# EAGLE design 2019_Dashboard_1-28-19 (EAGLE 9.1.3)
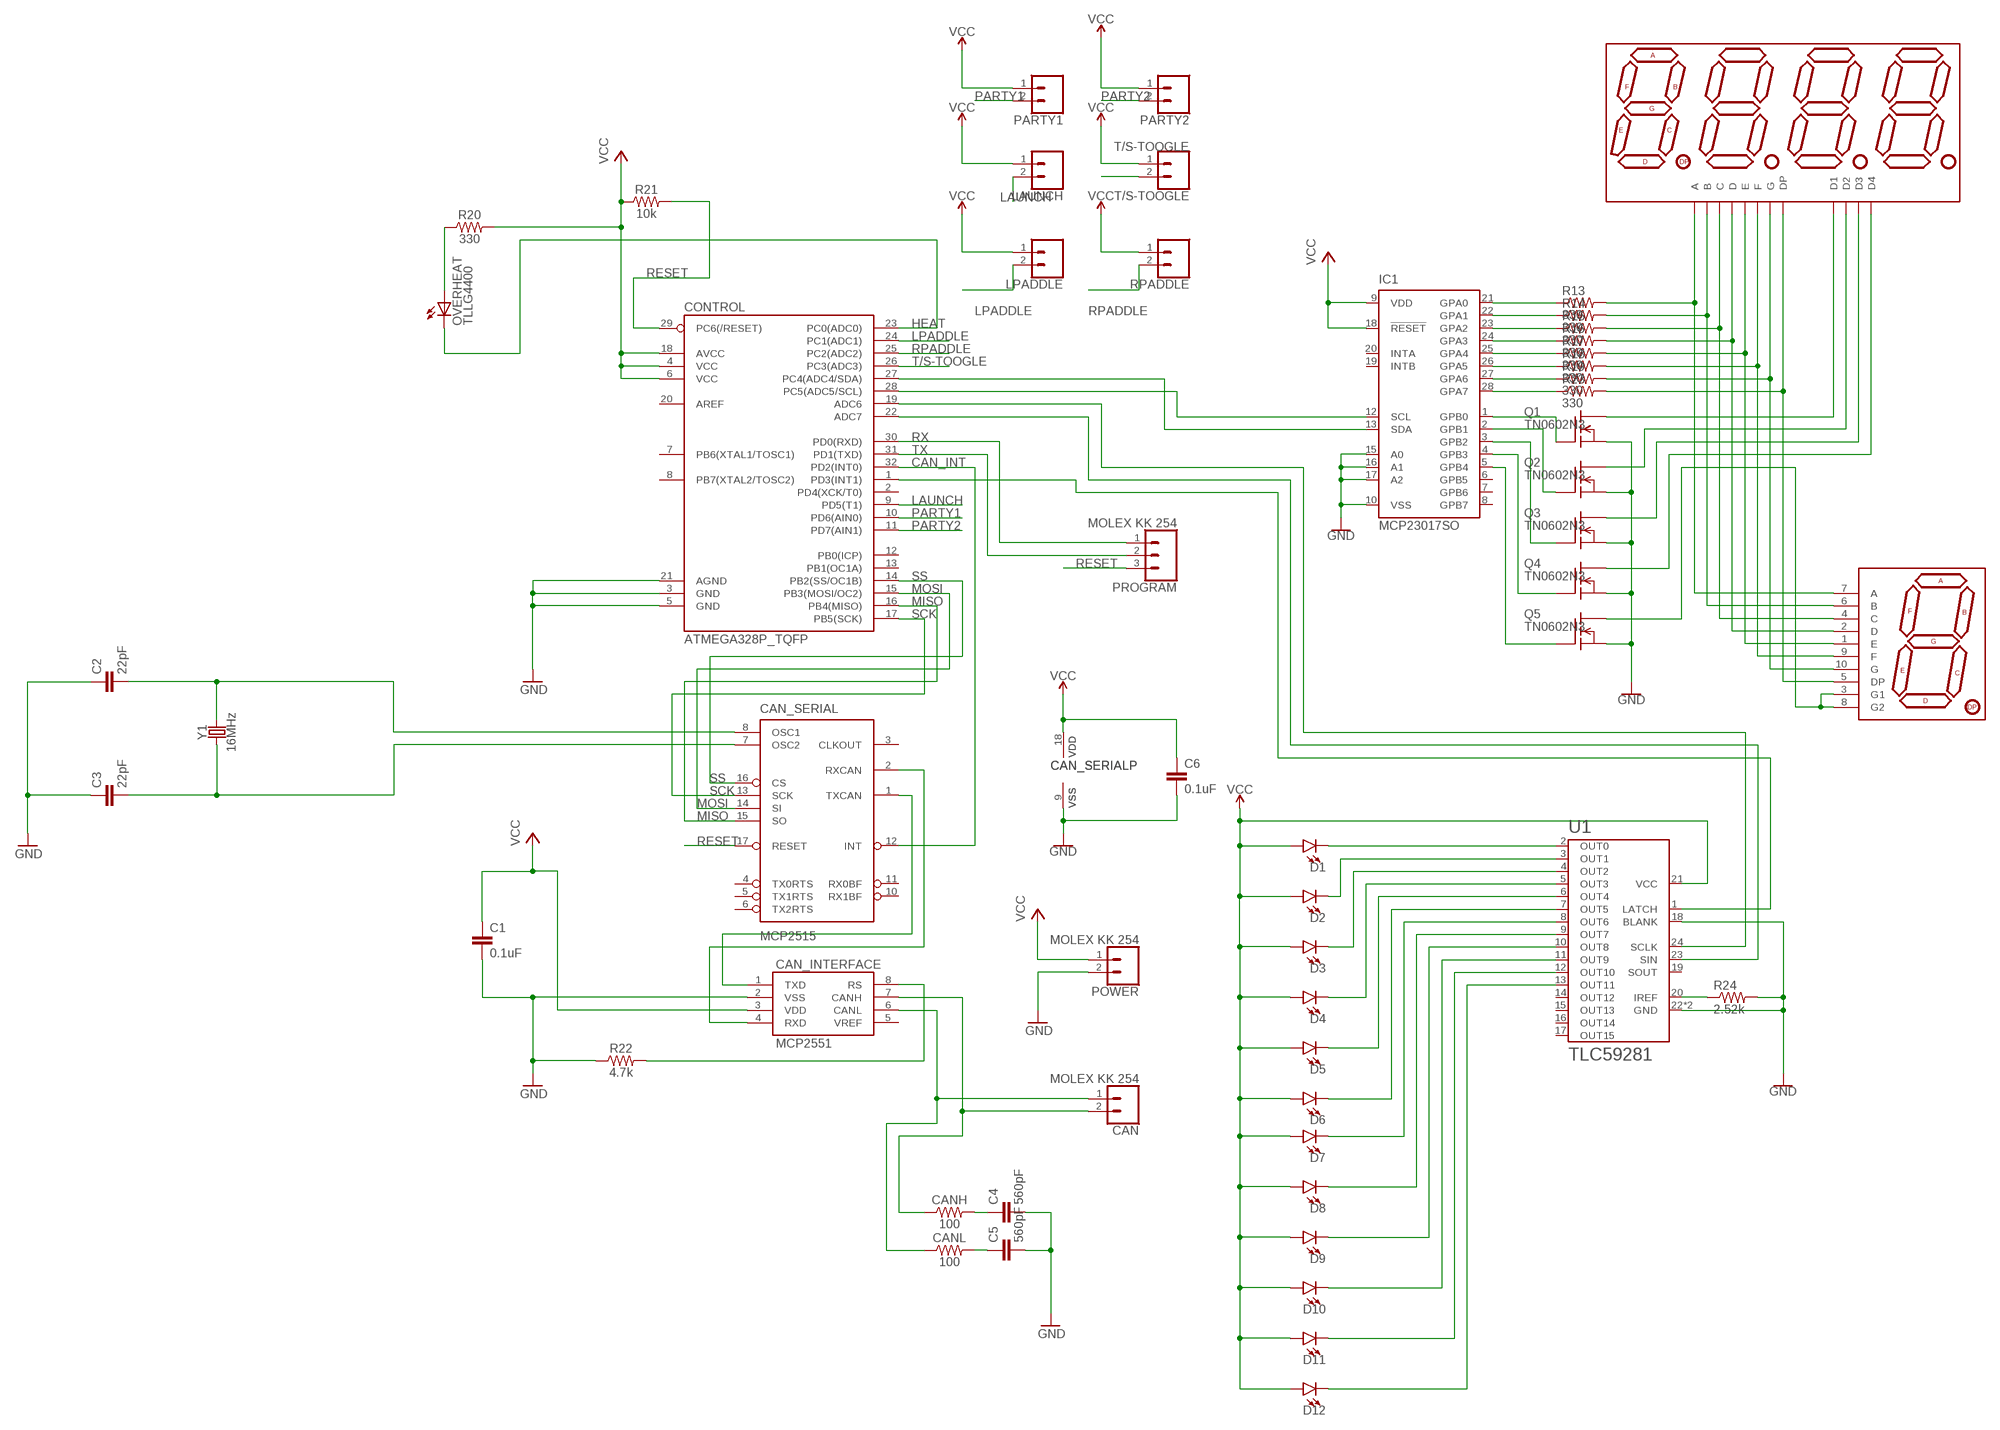
[diagram p0: schematic, sheet 1]

## Parts
C1  0.1uF  0.1UF-0603-25V-(+80/-20%)  [0603]
C2  22pF  22PF-0603-50V-5%  [0603]
C3  22pF  22PF-0603-50V-5%  [0603]
C4  560pF  560PF-0603-50V-5%  [0603]
C5  560pF  560PF-0603-50V-5%  [0603]
C6  0.1uF  0.1UF-0402-16V-10%  [0402]
CAN  MOLEX KK 254  CONN_02  [1X02]
CAN_INTERFACE  MCP2551  [SO08]
CAN_SERIAL  MCP2515  MCP2515(MCP2510)SO  [SO18W]
CANH  100  100OHM-0603-1/4W-5%  [0603]
CANL  100  100OHM-0603-1/4W-5%  [0603]
CONTROL  ATMEGA328P_TQFP  [TQFP32-08]
D1  LED5MM  [LED_5MM]
D2  LED5MM  [LED_5MM]
D3  LED5MM  [LED_5MM]
D4  LED5MM  [LED_5MM]
D5  LED5MM  [LED_5MM]
D6  LED5MM  [LED_5MM]
D7  LED5MM  [LED_5MM]
D8  LED5MM  [LED_5MM]
D9  LED5MM  [LED_5MM]
D10  LED5MM  [LED_5MM]
D11  LED5MM  [LED_5MM]
D12  LED5MM  [LED_5MM]
DISP1  ATA8041ARBJ  7-SEGMENT-4DIGIT-20MM-RED  [7-SEGMENT-4DIGIT-20MM]
IC1  MCP23017SO  [SO28W]
LAUNCH  CONN_02LOCK  [1X02_LOCK]
LPADDLE  CONN_02LOCK  [1X02_LOCK]
OVERHEAT  TLLG4400  [LED3MM]
PARTY1  CONN_02LOCK  [1X02_LOCK]
PARTY2  CONN_02LOCK  [1X02_LOCK]
POWER  MOLEX KK 254  CONN_02  [1X02]
PROGRAM  MOLEX KK 254  CONN_03  [1X03]
Q1  TN0602N3  [TO-92]
Q2  TN0602N3  [TO-92]
Q3  TN0602N3  [TO-92]
Q4  TN0602N3  [TO-92]
Q5  TN0602N3  [TO-92]
R13  330  R-US_R0603  [R0603]
R14  330  R-US_R0603  [R0603]
R15  330  R-US_R0603  [R0603]
R16  330  R-US_R0603  [R0603]
R17  330  R-US_R0603  [R0603]
R18  330  R-US_R0603  [R0603]
R19  330  R-US_R0603  [R0603]
R20  330  330OHM-0603-1/10W-1%  [0603]
R21  10k  10KOHM-0603-1/10W-1%  [0603]
R22  4.7k  4.7KOHM-0603-1/10W-1%  [0603]
R23  330  R-US_R0603  [R0603]
R24  2.52k  R-US_R0603  [R0603]
RPADDLE  CONN_02LOCK  [1X02_LOCK]
T/S-TOOGLE  CONN_02LOCK  [1X02_LOCK]
U1  TLC59281  [QFN-24]
U$1  YSD-1601AR4B-8  7-SEGMENT-1DIGIT-1INCH-RED  [7-SEGMENT-1"PTH]
Y1  16MHz  CRYSTAL-16MHZPTH-HC49US  [HC49US]

## Nets
CAN_INT: CAN_SERIAL.12(INT) CONTROL.32(PD2(INT0))
CANH: CAN.2 CAN_INTERFACE.7(CANH) CANH.1
CANL: CAN.1 CAN_INTERFACE.6(CANL) CANL.1
CHI: C4.1 CANH.2
CI_SLOPE: CAN_INTERFACE.8(RS) R22.2
CLI: C5.1 CANL.2
GND [power]: C1.2 C2.1 C3.1 C4.2 C5.2 C6.2 CAN_INTERFACE.2(VSS) CAN_SERIAL.9(VSS) CONTROL.3(GND) CONTROL.5(GND) CONTROL.21(AGND) IC1.10(VSS) IC1.15(A0) IC1.16(A1) IC1.17(A2) POWER.2 Q1.1(S) Q2.1(S) Q3.1(S) Q4.1(S) Q5.1(S) R22.1 R24.2 U1.18(BLANK) U1.22(GND) U1.EP(GND)
HEAT: CONTROL.23(PC0(ADC0)) OVERHEAT.K(C)
HEAT+: OVERHEAT.A R20.1
LAUNCH: CONTROL.9(PD5(T1)) LAUNCH.2
LPADDLE: CONTROL.24(PC1(ADC1)) LPADDLE.2
MISO: CAN_SERIAL.15(SO) CONTROL.16(PB4(MISO))
MOSI: CAN_SERIAL.14(SI) CONTROL.15(PB3(MOSI/OC2))
N$1: CONTROL.28(PC5(ADC5/SCL)) IC1.12(SCL)
N$2: CONTROL.27(PC4(ADC4/SDA)) IC1.13(SDA)
N$3 [led]: DISP1.11(A) R13.2 U$1.7(A)
N$4 [led]: DISP1.7(B) R14.2 U$1.6(B)
N$5 [led]: DISP1.4(C) R15.2 U$1.4(C)
N$6 [led]: DISP1.2(D) R16.2 U$1.2(D)
N$7 [led]: DISP1.1(E) R17.2 U$1.1(E)
N$8 [led]: DISP1.10(F) R18.2 U$1.9(F)
N$9 [led]: DISP1.5(G) R19.2 U$1.10(G)
N$10 [led]: DISP1.3(DP) R23.2 U$1.5(DP)
N$11 [led]: DISP1.12(D1) Q1.3(D)
N$12 [led]: DISP1.9(D2) Q2.3(D)
N$13 [led]: DISP1.8(D3) Q3.3(D)
N$14 [led]: DISP1.6(D4) Q4.3(D)
N$15 [led]: Q5.3(D) U$1.3(G1) U$1.8(G2)
N$18: CONTROL.19(ADC6) U1.24(SCLK)
N$19: CONTROL.22(ADC7) U1.23(SIN)
N$20: CONTROL.1(PD3(INT1)) U1.1(LATCH)
N$28: IC1.21(GPA0) R13.1
N$29: IC1.22(GPA1) R14.1
N$30: IC1.23(GPA2) R15.1
N$31: IC1.24(GPA3) R16.1
N$32: IC1.25(GPA4) R17.1
N$33: IC1.26(GPA5) R18.1
N$46: IC1.27(GPA6) R19.1
N$47: IC1.28(GPA7) R23.1
N$48: IC1.1(GPB0) Q1.2(G)
N$49: IC1.2(GPB1) Q2.2(G)
N$50: IC1.3(GPB2) Q3.2(G)
N$51: IC1.4(GPB3) Q4.2(G)
N$52: IC1.5(GPB4) Q5.2(G)
N$53: D1.K(C) U1.2(OUT0)
N$54: D2.K(C) U1.3(OUT1)
N$55: D3.K(C) U1.4(OUT2)
N$56: D4.K(C) U1.5(OUT3)
N$57: CAN_INTERFACE.1(TXD) CAN_SERIAL.1(TXCAN)
N$58: CAN_INTERFACE.4(RXD) CAN_SERIAL.2(RXCAN)
N$59: D5.K(C) U1.6(OUT4)
N$60: D6.K(C) U1.7(OUT5)
N$61: D7.K(C) U1.8(OUT6)
N$62: D8.K(C) U1.9(OUT7)
N$63: D9.K(C) U1.10(OUT8)
N$64: D10.K(C) U1.11(OUT9)
N$65: D11.K(C) U1.12(OUT10)
N$66: D12.K(C) U1.13(OUT11)
N$67: R24.1 U1.20(IREF)
OSC1: C2.2 CAN_SERIAL.8(OSC1) Y1.2
OSC2: C3.2 CAN_SERIAL.7(OSC2) Y1.1
PARTY1: CONTROL.10(PD6(AIN0)) PARTY1.2
PARTY2: CONTROL.11(PD7(AIN1)) PARTY2.2
RESET: CAN_SERIAL.17(RESET) CONTROL.29(PC6(/RESET)) PROGRAM.3 R21.2
RPADDLE: CONTROL.25(PC2(ADC2)) RPADDLE.2
RX: CONTROL.30(PD0(RXD)) PROGRAM.1
SCK: CAN_SERIAL.13(SCK) CONTROL.17(PB5(SCK))
SS: CAN_SERIAL.16(CS) CONTROL.14(PB2(SS/OC1B))
T/S-TOOGLE: CONTROL.26(PC3(ADC3)) T/S-TOOGLE.2
TX: CONTROL.31(PD1(TXD)) PROGRAM.2
VCC [power]: C1.1 C6.1 CAN_INTERFACE.3(VDD) CAN_SERIAL.18(VDD) CONTROL.4(VCC) CONTROL.6(VCC) CONTROL.18(AVCC) D1.A D2.A D3.A D4.A D5.A D6.A D7.A D8.A D9.A D10.A D11.A D12.A IC1.9(VDD) IC1.18(!RESET) LAUNCH.1 LPADDLE.1 PARTY1.1 PARTY2.1 POWER.1 R20.2 R21.1 RPADDLE.1 T/S-TOOGLE.1 U1.21(VCC)
Unconnected: CAN_INTERFACE.5(VREF) CAN_SERIAL.3(CLKOUT) CAN_SERIAL.4(TX0RTS) CAN_SERIAL.5(TX1RTS) CAN_SERIAL.6(TX2RTS) CAN_SERIAL.10(RX1BF) CAN_SERIAL.11(RX0BF) CONTROL.2(PD4(XCK/T0)) CONTROL.7(PB6(XTAL1/TOSC1)) CONTROL.8(PB7(XTAL2/TOSC2)) CONTROL.12(PB0(ICP)) CONTROL.13(PB1(OC1A)) CONTROL.20(AREF) IC1.6(GPB5) IC1.7(GPB6) IC1.8(GPB7) IC1.19(INTB) IC1.20(INTA) U1.14(OUT12) U1.15(OUT13) U1.16(OUT14) U1.17(OUT15) U1.19(SOUT)

## Library data of the parts
C1 = SparkFun-Capacitors:0.1UF: 0.1µF ceramic capacitors A capacitor is a passive two-terminal electrical component used to store electrical energy temporarily in an electric field.; PROD_ID: CAP-00810
C2 C3 = SparkFun-Capacitors:22PF: 22pF ceramic capacitors A capacitor is a passive two-terminal electrical component used to store electrical energy temporarily in an electric field.; PROD_ID: CAP-07876
C4 C5 = SparkFun-Capacitors:560PF: 0.56nF/560pF ceramic capacitors A capacitor is a passive two-terminal electrical component used to store electrical energy temporarily in an electric field.; PROD_ID: CAP-08749
C6 = SparkFun-Capacitors:0.1UF: 0.1µF ceramic capacitors A capacitor is a passive two-terminal electrical component used to store electrical energy temporarily in an electric field.; PROD_ID: CAP-12416
CAN LAUNCH LPADDLE PARTY1 PARTY2 POWER RPADDLE T/S-TOOGLE = SparkFun-Connectors:CONN_02: Multi connection point. Often used as Generic Header-pin footprint for 0.1 inch spaced/style header connections On any of the 0.1 inch spaced packages, you can populate with these: Break Away Headers - Straight <https://www.sparkfun.com/products/116> (PRT-00116) Break Away Male Headers - Right Angle <https://www.sparkfun.com/products/553> (PRT-00553) Female Headers <https://www.sparkfun.com/products/115> (PRT-00115) Break Away Headers - Machine Pin <https://www.sparkfun.com/products/117> (PRT-00117) Break Away Female Headers - Swiss Machine Pin <https://www.sparkfun.com/products/743> (PRT-00743) For SCREWTERMINALS and SPRING TERMINALS visit here: Screw Terimnals on SparkFun.com <https://www.sparkfun.com/search/results?term=Screw+Terminals> (5mm/3.5mm/2.54mm spacing) This device is also useful as a general connection point to wire up your design to another part of your project. Our various solder wires solder well into these plated through hole pads. Hook-Up Wire - Assortment (Stranded, 22 AWG) <https://www.sparkfun.com/products/11375> (PRT-11375) Hook-Up Wire - Assortment (Solid Core, 22 AWG) <https://www.sparkfun.com/products/11367> (PRT-11367) View the entire wire category on our website here <https://www.sparkfun.com/categories/141> Special notes: Molex polarized connector foot print use with: PRT-08233 with associated crimp pins and housings. 2.54_SCREWTERM for use with PRT-10571. 3.5mm Screw Terminal footprints for PRT-08084 5mm Screw Terminal footprints for use with PRT-08432
CAN_INTERFACE = SparkFun-IC-Comms:MCP2551: MCP2551 High Speed CAN Transceiver High speed CAN transceiver Datasheet <http://www.sparkfun.com/datasheets/DevTools/Arduino/MCP2551.pdf> SparkFun Products CAN-BUS Shield <https://www.sparkfun.com/products/13262> (DEV-13262) SparkFun OBD-II UART <https://www.sparkfun.com/products/9555> (WIG-09555); PROD_ID: IC-09907
CAN_SERIAL = SparkFun-IC-Comms:MCP2515(MCP2510): CAN controller with SPI interface The MCP2515 controller supercedes the MCP2510 while addressing all errata associated with it. The two devices are pin compatible, either can be used with this device. 18-pin package SOIC Simple SPI interface to any MCU. One-shot mode ensures message transmission is attempted only once Databyte filtering Start-of-Frame (SOF) output Low-power CMOS Technology Datasheet <http://www.sparkfun.com/datasheets/DevTools/Arduino/MCP2515.pdf> SparkFun Products CAN-BUS Shield <https://www.sparkfun.com/products/13262> (DEV-13262); PROD_ID: IC-09906
CANH CANL = SparkFun-Resistors:100OHM: 100Ω resistor A resistor is a passive two-terminal electrical component that implements electrical resistance as a circuit element. Resistors act to reduce current flow, and, at the same time, act to lower voltage levels within circuits. - Wikipedia; PROD_ID: RES-12438
CONTROL = SparkFun-IC-Microcontroller:ATMEGA328P_TQFP: Popular 328P in QFP Storefront component: ATmega328 - TQFP <https://www.sparkfun.com/products/13448> (COM-13448) Datasheet <http://www.sparkfun.com/datasheets/Components/SMD/ATMega328.pdf> SparkFun Products SparkFun RedBoard - Programmed with Arduino <https://www.sparkfun.com/products/12757> (DEV-12757) Arduino Pro Mini 328 - 5V/16MHz <https://www.sparkfun.com/products/11113> (DEV-11113) Arduino Pro Mini 328 - 3.3V/8MHz <https://www.sparkfun.com/products/11114> (DEV-11114) SparkFun OpenLog <https://www.sparkfun.com/products/13712> (DEV-13712) SparkFun MicroView - OLED Arduino Module <https://www.sparkfun.com/products/12923> (DEV-12923) SparkFun Digital Sandbox <https://www.sparkfun.com/products/12651> (DEV-12651) SparkFun PicoBoard <https://www.sparkfun.com/products/11888> (WIG-11888) Arduino Fio <https://www.sparkfun.com/products/10116> (DEV-10116) LilyPad Arduino 328 Main Board <https://www.sparkfun.com/products/13342> (DEV-13342) SparkFun RedStick <https://www.sparkfun.com/products/13741> (DEV-13741) LilyPad MP3 <https://www.sparkfun.com/products/11013> (DEV-11013) LilyPad Arduino SimpleSnap <https://www.sparkfun.com/products/10941> (DEV-10941) SparkFun Stepoko <https://www.sparkfun.com/products/13899> (ROB-13899) SparkFun Geiger Counter <https://www.sparkfun.com/products/11345> (SEN-11345) SparkFun EL Sequencer <https://www.sparkfun.com/products/12781> (COM-12781) Arduino Pro 328 - 5V/16MHz <https://www.sparkfun.com/products/10915> (DEV-10915) CryptoCape <https://www.sparkfun.com/products/12773> (DEV-12773) SparkFun IR Thermometer Evaluation Board - MLX90614 <https://www.sparkfun.com/products/10740> (SEN-10740) SparkFun RedBot Mainboard <https://www.sparkfun.com/products/12097> (ROB-12097) Arduino Pro 328 - 3.3V/8MHz <https://www.sparkfun.com/products/10914> (DEV-10914) SparkFun Block for Intel® Edison - Arduino <https://www.sparkfun.com/products/13036> (DEV-13036) SparkFun Simon Says - Surface Mount Soldering Kit <https://www.sparkfun.com/products/10935> (KIT-10935) SparkFun 7-Segment Serial Display - Red <https://www.sparkfun.com/products/11441> (COM-11441) SparkFun 7-Segment Serial Display - White <https://www.sparkfun.com/products/11629> (COM-11629) SparkFun 7-Segment Serial Display - Yellow <https://www.sparkfun.com/products/11443> (COM-11443) SparkFun 7-Segment Serial Display - Kelly Green <https://www.sparkfun.com/products/11440> (COM-11440) SparkFun 7-Segment Serial Display - Blue <https://www.sparkfun.com/products/11442> (COM-11442) SparkFun OpenSegment Serial Display - 20mm (Blue) <https://www.sparkfun.com/products/11647> (COM-11647) SparkFun OpenSegment Serial Display - 20mm (Green) <https://www.sparkfun.com/products/11646> (COM-11646) SparkFun OpenSegment Serial Display - 20mm (White) <https://www.sparkfun.com/products/11648> (COM-11648) SparkFun OpenSegment Serial Display - 20mm (Red) <https://www.sparkfun.com/products/11644> (COM-11644) SparkFun OpenSegment Serial Display - 20mm (Yellow) <https://www.sparkfun.com/products/11645> (COM-11645) SparkFun OpenSegment Shield <https://www.sparkfun.com/products/13190> (DEV-13190); PROD_ID: IC-09069
D1-D12 = SparkFun-LED:LED: LED (Generic) Standard schematic elements and footprints for 5mm, 3mm, 1206, and 0603 sized LEDs. Generic LEDs with no color specified.
DISP1 = SparkFun-LED:7-SEGMENT-4DIGIT-20MM: 4 Digit 7 Segment Display This is a part for the 4-Digit 7-segment LEDs from Young Sun. Different from the Digikey LEDs, all 16 pins are used. The LONGPADS Variant is used for a test jig, but you may like it because there is more pad to solder to. If you are concerned about routing space, the standard works just fine though. Datasheets: Red <http://cdn.sparkfun.com/datasheets/Components/LED/1LEDREDCC.pdf> Yellow <http://cdn.sparkfun.com/datasheets/Components/LED/1LEDYELCC.pdf> Green <http://cdn.sparkfun.com/datasheets/Components/LED/1LEDGRNCC.pdf> Blue <http://cdn.sparkfun.com/datasheets/Components/LED/1LEDBLUCC.pdf> White <http://cdn.sparkfun.com/datasheets/Components/LED/1LEDWHTCC.pdf> SparkFun Products Raw Components 7-Segment Display - 20mm (Red) <https://www.sparkfun.com/products/11405> (COM-11405) 7-Segment Display - 20mm (Yellow) <https://www.sparkfun.com/products/11406> (COM-11406) 7-Segment Display - 20mm (Green) <https://www.sparkfun.com/products/11407> (COM-11407) 7-Segment Display - 20mm (Blue) <https://www.sparkfun.com/products/11408> (COM-11408) 7-Segment Display - 20mm (White) <https://www.sparkfun.com/products/11409> (COM-11409) Serial Controlled SparkFun OpenSegment Serial Display - 20mm (Red) <https://www.sparkfun.com/products/11644> (COM-11644) SparkFun OpenSegment Serial Display - 20mm (Yellow) <https://www.sparkfun.com/products/11645> (COM-11645) SparkFun OpenSegment Serial Display - 20mm (Green) <https://www.sparkfun.com/products/11646> (COM-11646) SparkFun OpenSegment Serial Display - 20mm (Blue) <https://www.sparkfun.com/products/11647> (COM-11647) SparkFun OpenSegment Serial Display - 20mm (White) <https://www.sparkfun.com/products/11648> (COM-11648) Other SparkFun OpenSegment Shield <https://www.sparkfun.com/products/13190> (DEV-13190); PROD_ID: COMP-11449
IC1 = adafruit:MCP23017: http://ww1.microchip.com/downloads/en/DeviceDoc/21952a.pdf Source: http://ww1.microchip.com/downloads/en/DeviceDoc/21952a.pdf
OVERHEAT = led:TLLG4400: Low Current (2mA) LED 3 mm Tinted Diffused Package color GREEN Source: Data sheet <http://www.farnell.com/datasheets/391098.pdf>; MF: VISHAY SEMICONDUCTOR; OC_FARNELL: 1612435
PROGRAM = SparkFun-Connectors:CONN_03: Multi connection point. Often used as Generic Header-pin footprint for 0.1 inch spaced/style header connections On any of the 0.1 inch spaced packages, you can populate with these: Break Away Headers - Straight <https://www.sparkfun.com/products/116> (PRT-00116) Break Away Male Headers - Right Angle <https://www.sparkfun.com/products/553> (PRT-00553) Female Headers <https://www.sparkfun.com/products/115> (PRT-00115) Break Away Headers - Machine Pin <https://www.sparkfun.com/products/117> (PRT-00117) Break Away Female Headers - Swiss Machine Pin <https://www.sparkfun.com/products/743> (PRT-00743) Stackable Header - 3 Pin (Female, 0.1") <https://www.sparkfun.com/products/13875> (PRT-13875) For SCREWTERMINALS and SPRING TERMINALS visit here: Screw Terimnals on SparkFun.com <https://www.sparkfun.com/search/results?term=Screw+Terminals> (5mm/3.5mm/2.54mm spacing) This device is also useful as a general connection point to wire up your design to another part of your project. Our various solder wires solder well into these plated through hole pads. Hook-Up Wire - Assortment (Stranded, 22 AWG) <https://www.sparkfun.com/products/11375> (PRT-11375) Hook-Up Wire - Assortment (Solid Core, 22 AWG) <https://www.sparkfun.com/products/11367> (PRT-11367) View the entire wire category on our website here <https://www.sparkfun.com/categories/141> Special notes: Molex polarized connector foot print use with SKU : PRT-08232 with associated crimp pins and housings.
Q1-Q5 = transistor-fet:TN0602N3: N-Channel Enhancement MOSFET 20V; 4A; 0,75Ohm
R13-R19 R23 R24 = resistor:R-US_: RESISTOR, American symbol
R20 = SparkFun-Resistors:330OHM: 330Ω resistor A resistor is a passive two-terminal electrical component that implements electrical resistance as a circuit element. Resistors act to reduce current flow, and, at the same time, act to lower voltage levels within circuits. - Wikipedia; PROD_ID: RES-00818
R21 = SparkFun-Resistors:10KOHM: 10kΩ resistor A resistor is a passive two-terminal electrical component that implements electrical resistance as a circuit element. Resistors act to reduce current flow, and, at the same time, act to lower voltage levels within circuits. - Wikipedia; PROD_ID: RES-00824
R22 = SparkFun-Resistors:4.7KOHM: 4.7kΩ resistor A resistor is a passive two-terminal electrical component that implements electrical resistance as a circuit element. Resistors act to reduce current flow, and, at the same time, act to lower voltage levels within circuits. - Wikipedia; PROD_ID: RES-07857
U1 = TLC59281:TLC59281; AVAILABILITY: Unavailable; DESCRIPTION: 16-Channel Constant-Current LED Driver without LED Open Detection; MF: Texas Instruments; MP: TLC59281; PACKAGE: None; PRICE: None
U$1 = SparkFun-LED:7-SEGMENT-1DIGIT-1INCH: 7-Segment Display, single digit, 1" EZ is for kits. Pads are only exposed on the bottom side to help prevent soldering in upside down. Datasheet (Red) <https://cdn.sparkfun.com/datasheets/Components/LED/YSD-160AR4B-8.pdf> Datasheet (Blue) <https://cdn.sparkfun.com/datasheets/Components/LED/YSD-160AB3C-8.pdf> SparkFun Products 7-Segment Display - LED (Red) <https://www.sparkfun.com/products/8546> (COM-08546) 7-Segment Display - LED (Blue) <https://www.sparkfun.com/products/9191> (COM-09191); PROD_ID: COMP-08615
Y1 = SparkFun-Clocks:CRYSTAL-16MHZ: 16MHz Crystal Digikey Example <http://www.digikey.com/product-search/en?keywords=535-9122-1-ND> Frequency: 16MHz Frequency Stability: ±50ppm Frequency Tolerance: ±20ppm Load Capacitance: 18pF SparkFun Products: Pro Micro -5V/16MHz <https://www.sparkfun.com/products/12640> SparkFun Serial Enabled LCD Kit <https://www.sparkfun.com/products/10097>; PROD_ID: XTAL-08181; SF_ID: COM-00536

## Net classes
1 power: width 0.406 mm
2 led: width 0.203 mm

## Board
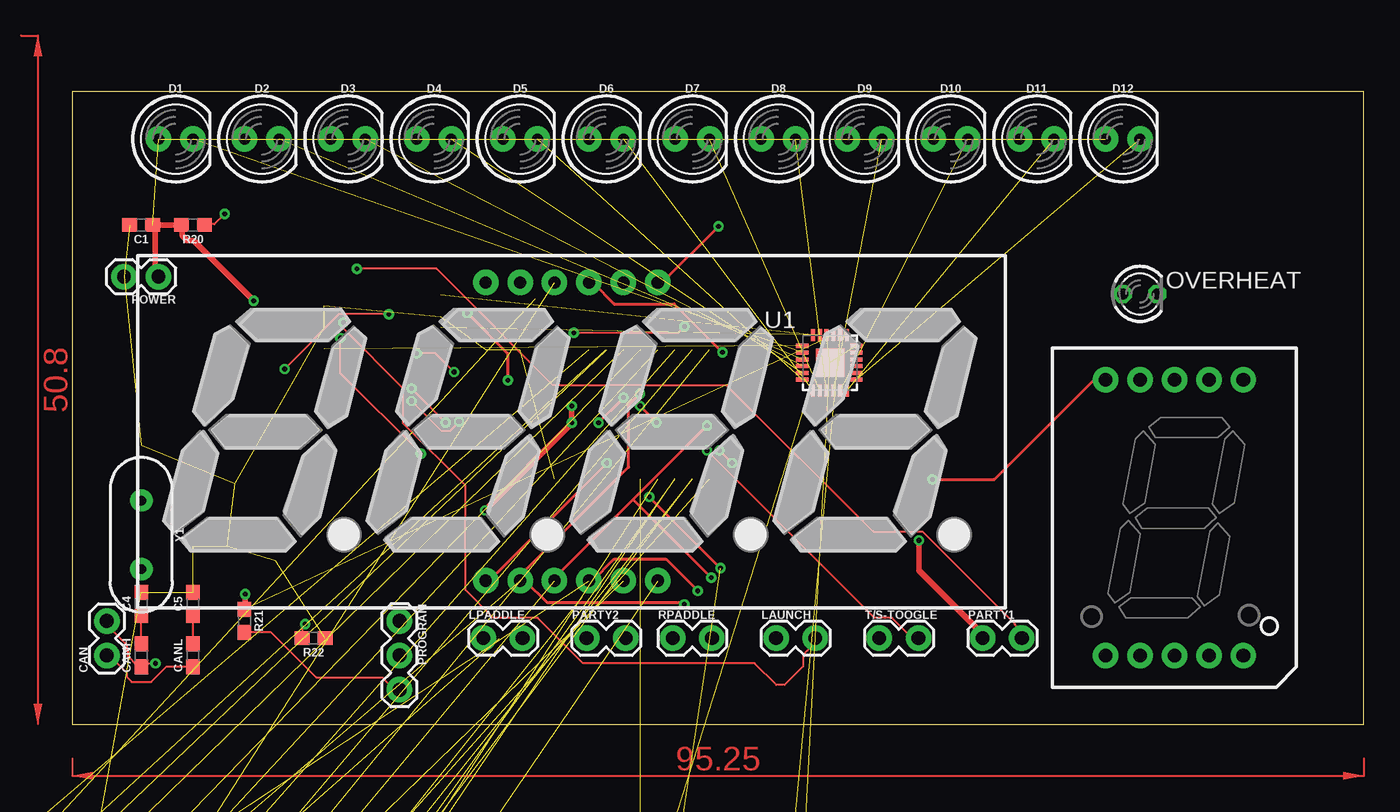
[diagram p1: board, top side]
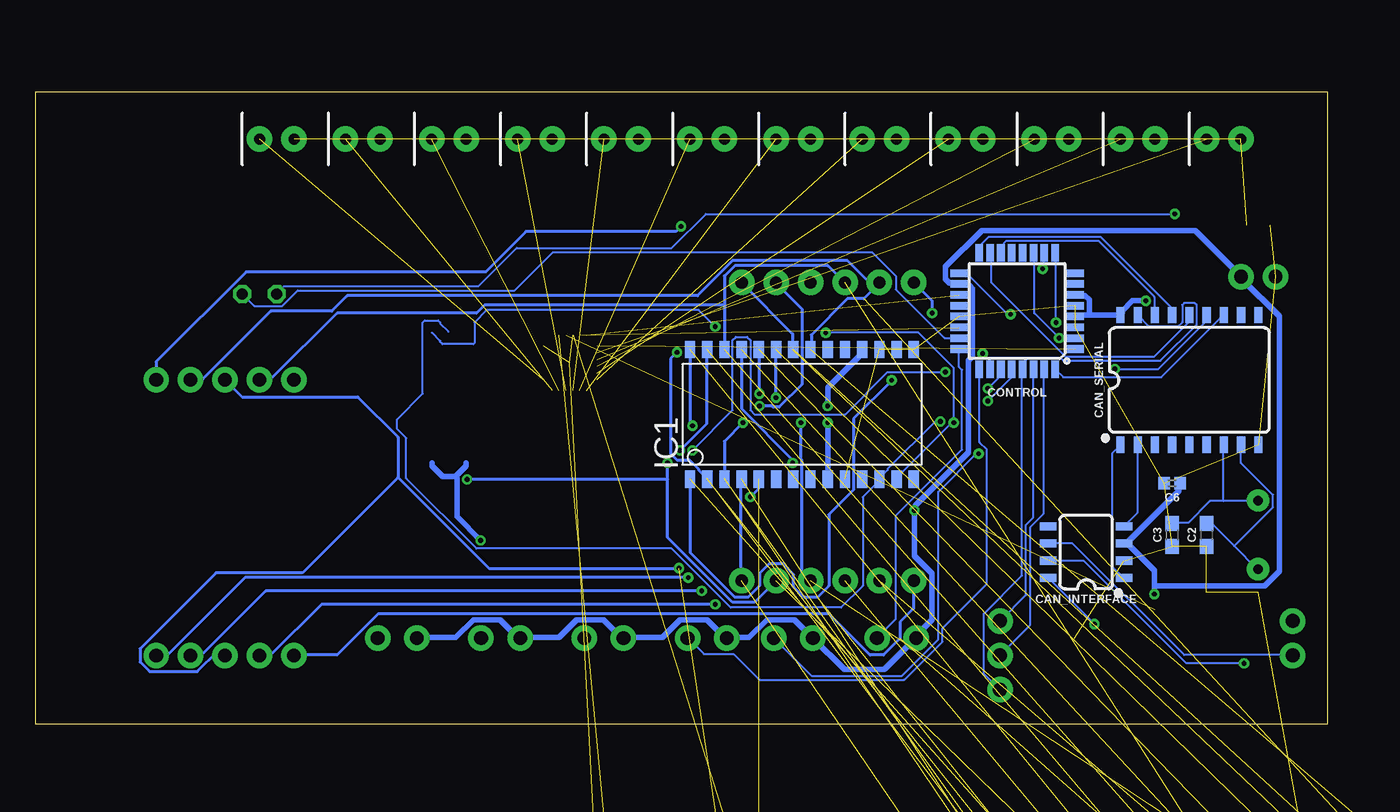
[diagram p2: board, bottom side, seen from below]

Size 95.23 x 46.66 mm. Coordinates in mm from the lower left corner, seen from the top.
Outline: 0,0 95.23,0 95.23,46.66 0,46.66 0,0
Copper layers (1*16): Top 0.035mm / dielectric 1.5mm / Bottom 0.035mm
Design rules "default": minimum track width 6mil, minimum drill 0.35mm, track to track 6mil, track to pad 6mil, pad to pad 6mil, via to via 6mil, smd to smd 6mil, copper to edge 40mil, drill to drill 6mil, minimum pad ring 10mil, minimum via ring 8mil, stop-mask expansion 4mil, vias tented up to drill 0mil, thermal gap 10mil
Holes 1 mm at 137.16,36.83 137.16,46.99 137.16,44.45 137.16,41.91 137.16,39.37 137.16,34.29

### Footprints (pad centres in the part's own frame; a part is rotated, then mirrored left to right if it is on the bottom)
0603 = smd 1.1 x 1: 1 -0.85,0; 2 0.85,0
0402 = smd 0.85 x 0.9: 1 -0.58,0; 2 0.58,0
1X02 = drill 1.016 pad 1.88: 1 0,0; 2 2.54,0
SO08 = smd 0.6 x 1.2: 1 -1.905,-2.8; 2 -0.635,-2.8; 3 0.635,-2.8; 4 1.905,-2.8; 5 1.905,2.8; 6 0.635,2.8; 7 -0.635,2.8; 8 -1.905,2.8
SO18W = smd 0.6 x 1.2: 1 -5.08,-4.788; 2 -3.81,-4.788; 3 -2.54,-4.788; 4 -1.27,-4.788; 5 0,-4.788; 6 1.27,-4.788; 7 2.54,-4.788; 8 3.81,-4.788; 9 5.08,-4.788; 10 5.08,4.788; 11 3.81,4.788; 12 2.54,4.788; 13 1.27,4.788; 14 0,4.788; 15 -1.27,4.788; 16 -2.54,4.788; 17 -3.81,4.788; 18 -5.08,4.788
TQFP32-08 = smd 1.27 x 0.559: 1 -4.293,2.8; 2 -4.293,2; 3 -4.293,1.2; 4 -4.293,0.4; 5 -4.293,-0.4; 6 -4.293,-1.2; 7 -4.293,-2; 8 -4.293,-2.8; 17 4.293,-2.8; 18 4.293,-2; 19 4.293,-1.2; 20 4.293,-0.4; 21 4.293,0.4; 22 4.293,1.2; 23 4.293,2; 24 4.293,2.8 | smd 0.559 x 1.27: 9 -2.8,-4.293; 10 -2,-4.293; 11 -1.2,-4.293; 12 -0.4,-4.293; 13 0.4,-4.293; 14 1.2,-4.293; 15 2,-4.293; 16 2.8,-4.293; 25 2.8,4.293; 26 2,4.293; 27 1.2,4.293; 28 0.4,4.293; 29 -0.4,4.293; 30 -1.2,4.293; 31 -2,4.293; 32 -2.8,4.293
LED_5MM = drill 0.813 pad 1.88: A -1.27,0; K 1.27,0
7-SEGMENT-4DIGIT-20MM = drill 0.9 pad 1.88: 1 -6.35,-10.998; 2 -3.81,-10.998; 3 -1.27,-10.998; 4 1.27,-10.998; 5 3.81,-10.998; 6 6.35,-10.998; 7 6.35,10.998; 8 3.81,10.998; 9 1.27,10.998; 10 -1.27,10.998; 11 -3.81,10.998; 12 -6.35,10.998
SO28W = smd 0.762 x 1.27: 1 -7.62,-4.78; 2 -6.35,-4.78; 3 -5.08,-4.78; 4 -3.81,-4.78; 5 -2.54,-4.78; 6 -1.27,-4.78; 7 0,-4.78; 8 1.27,-4.78; 9 2.54,-4.78; 10 3.81,-4.78; 11 5.08,-4.78; 12 6.35,-4.78; 13 7.62,-4.78; 14 8.89,-4.78; 15 8.89,4.78; 16 7.62,4.78; 17 6.35,4.78; 18 5.08,4.78; 19 3.81,4.78; 20 2.54,4.78; 21 1.27,4.78; 22 0,4.78; 23 -1.27,4.78; 24 -2.54,4.78; 25 -3.81,4.78; 26 -5.08,4.78; 27 -6.35,4.78; 28 -7.62,4.78
1X02_LOCK = drill 1.016 pad 1.88: 1 -0.178,0; 2 2.718,0
LED3MM = drill 0.813 octagon: A -1.27,0; K 1.27,0
1X03 = drill 1.016 pad 1.88: 1 0,0; 2 2.54,0; 3 5.08,0
TO-92 = drill 0.813 octagon: 1 -1.27,0; 2 0,1.905; 3 1.27,0
R0603 = smd 1 x 1.1: 1 -0.85,0; 2 0.85,0
QFN-24 = smd 0.9 x 0.3: 1 -2.05,1.25; 2 -2.05,0.75; 3 -2.05,0.25; 4 -2.05,-0.25; 5 -2.05,-0.75; 6 -2.05,-1.25; 13 1.95,-1.25; 14 1.95,-0.75; 15 1.95,-0.25; 16 1.95,0.25; 17 1.95,0.75; 18 1.95,1.25 | smd 0.3 x 0.9: 7 -1.25,-2.05; 8 -0.75,-2.05; 9 -0.25,-2.05; 10 0.25,-2.05; 11 0.75,-2.05; 12 1.25,-2.05; 19 1.25,2.05; 20 0.75,2.05; 21 0.25,2.05; 22 -0.25,2.05; 23 -0.75,2.05; 24 -1.25,2.05 | smd 2.1 x 2.1: EP 0,0
7-SEGMENT-1"PTH = drill 1 pad 1.88: 1 -5.08,-10.16; 2 -2.54,-10.16; 3 0,-10.16; 4 2.54,-10.16; 5 5.08,-10.16; 6 5.08,10.16; 7 2.54,10.16; 8 0,10.16; 9 -2.54,10.16; 10 -5.08,10.16
HC49US = drill 0.7 pad 1.651: 1 -2.54,0; 2 2.54,0

### Placement (x,y rotation side)
C1  5.08,36.83 180 top
C2  8.89,13.97 90 bottom
C3  11.43,13.97 90 bottom
C4  5.08,8.89 90 top
C5  8.89,8.89 90 top
C6  11.43,17.78 180 bottom
CAN  2.54,5.08 90 top
CAN_INTERFACE  17.78,12.7 90 bottom
CAN_SERIAL  10.16,25.4 0 bottom
CANH  5.08,5.08 90 top
CANL  8.89,5.08 90 top
CONTROL  22.86,30.48 180 bottom
D1  7.62,43.18 0 top
D2  13.97,43.18 0 top
D3  20.32,43.18 0 top
D4  26.67,43.18 0 top
D5  33.02,43.18 0 top
D6  39.37,43.18 0 top
D7  45.72,43.18 0 top
D8  52.07,43.18 0 top
D9  58.42,43.18 0 top
D10  64.77,43.18 0 top
D11  71.12,43.18 0 top
D12  77.47,43.18 0 top
DISP1  36.83,21.59 0 top
IC1  39.37,22.86 0 bottom
LAUNCH  52.07,6.35 0 top
LPADDLE  30.48,6.35 0 top
OVERHEAT  78.74,31.75 0 top
PARTY1  67.31,6.35 0 top
PARTY2  38.1,6.35 0 top
POWER  6.35,33.02 180 top
PROGRAM  24.13,7.62 270 top
Q1  -2.54,-39.37 0 top  (outside the outline)
Q2  -2.54,-44.45 0 top  (outside the outline)
Q3  -2.54,-49.53 0 top  (outside the outline)
Q4  -2.54,-54.61 0 top  (outside the outline)
Q5  41.91,-19.05 0 top  (outside the outline)
R13  -3.81,-8.89 0 top  (outside the outline)
R14  -3.81,-12.7 0 top  (outside the outline)
R15  -3.81,-16.51 0 top  (outside the outline)
R16  -3.81,-20.32 0 top  (outside the outline)
R17  -3.81,-24.13 0 top  (outside the outline)
R18  -3.81,-27.94 0 top  (outside the outline)
R19  -3.81,-31.75 0 top  (outside the outline)
R20  8.89,36.83 180 top
R21  12.7,7.62 270 top
R22  17.78,6.35 180 top
R23  -3.81,-35.56 0 top  (outside the outline)
R24  52.07,-29.21 0 top  (outside the outline)
RPADDLE  44.45,6.35 0 top
T/S-TOOGLE  59.69,6.35 0 top
U1  55.88,26.67 0 top
U$1  81.28,15.24 0 top
Y1  5.08,13.97 270 top

### Tracks (layer width: path | path; a pad name or v marks a point on that pad's centre or on a via)
CAN_INT
  Bottom 0.152: CAN_SERIAL.12 7.64,30.18 12.22,25.6 19.46,25.6 19.99,26.14 CONTROL.32
CANH  (via drill 0.35)
  Top 0.152: CAN.2 2.54,7.32 3.99,5.87 3.99,5.49 4.06,5.41 4.06,5.03 4.83,4.27 5.05,4.27 CANH.1 5.13,4.27 5.36,4.5 v6.12,4.5
  Bottom 0.152: v6.12,4.5 10.39,4.5 17.93,12.04 20.52,12.04 CAN_INTERFACE.7
CANL
  Top 0.152: CANL.1 8.86,4.27 6.96,4.27 5.82,3.12 4.37,3.12 3.99,3.5 3.99,3.81 2.77,5.03 2.54,5.03 CAN.1
  Bottom 0.152: CAN_INTERFACE.6 20.52,13.33 18.77,13.33 10.54,5.11 2.54,5.11 CAN.1
CHI
  Top 0.152: CANH.2 5.05,5.94 5.05,8 C4.1
CI_SLOPE  (via drill 0.35)
  Top 0.152: v17.17,7.39 16.94,7.16 16.94,6.4 R22.2
  Bottom 0.152: v17.17,7.39 20.52,10.74 CAN_INTERFACE.8
CLI
  Top 0.152: CANL.2 8.86,5.94 8.86,8 C5.1
GND  (25 unrouted)
HEAT
  Bottom 0.152: CONTROL.23 27.15,28.5 28.22,28.5 31.8,32.08 31.8,33.07 33.55,34.82 57.1,34.82 59.92,32 75.92,32 77.06,30.86 79.12,30.86 79.96,31.7 OVERHEAT.K
HEAT+  (via drill 0.35)
  Top 0.152: v11.23,37.64 10.46,36.88 9.78,36.88 R20.1
  Bottom 0.152: v11.23,37.64 45.82,37.64 48.34,35.13 59.77,35.13 62.59,32.31 76.91,32.31 77.44,31.78 OVERHEAT.A
LAUNCH  (via drill 0.35)
  Top 0.152: v19.99,29.64 19.99,29.18 24.41,24.76 24.41,22.17 28.98,17.6 28.98,9.91 31.04,7.85 34.32,7.85 37.67,4.5 50.32,4.5 51.92,2.9 52.53,2.9 53.9,4.27 53.9,5.11 54.74,5.94 54.74,6.32 LAUNCH.2
  Bottom 0.152: v19.99,29.64 19.99,34.75 CONTROL.9
LPADDLE
  Bottom 0.152: CONTROL.24 27.15,27.66 27.15,26.36 26.92,26.14 26.92,20.27 31.8,15.39 31.8,7.77 33.17,6.4 LPADDLE.2
MISO
  Bottom 0.152: CAN_SERIAL.15 11.45,30.25 11.45,30.71 16.71,35.97 24.94,35.97 25.63,35.28 25.63,34.82 CONTROL.16
MOSI
  Bottom 0.152: CAN_SERIAL.14 10.16,30.18 10.16,29.72 12.75,27.13 19.3,27.13 24.79,32.61 24.79,34.75 CONTROL.15
N$1  (via drill 0.35)
  Top 0.152: v28.52,22.33 27.84,21.64 27.23,21.64 v25.02,23.85
  Bottom 0.152: v28.52,22.33 28.9,22.33 32.41,18.82 32.41,18.75 33.02,18.14 IC1.12 33.02,18.06 33.02,17.98 34.24,16.76 34.24,10.21 35.84,8.61 43.99,8.61 48.34,12.95 62.74,12.95 67.92,18.14 67.92,21.11 68.6,21.79 68.6,22.48 66.7,24.38 66.7,29.64 66.55,29.79 65.56,29.79 65.41,29.64 65.41,29.57 64.79,28.96 | v25.02,23.85 23.27,25.6 23.27,26.14 CONTROL.28
N$2  (via drill 0.35)
  Top 0.152: v27.53,22.25 v25.02,24.76 | v45.14,29.34 44.68,28.88 v36.98,28.88
  Bottom 0.152: v25.02,24.76 24.1,25.68 24.1,26.14 CONTROL.27 | IC1.13 31.8,18.14 27.69,22.25 v27.53,22.25 27.53,26.29 30.12,28.88 v36.98,28.88 | 66.01,28.88 65.41,28.27 65.41,28.19 65.25,28.04 62.97,28.04 62.89,28.12 62.89,29.64 61.98,30.56 46.35,30.56 v45.14,29.34
N$3  (1 unrouted)
  Bottom 0.203: 38.05,27.66 38.05,28.73 35.38,31.39 34.16,31.39 33.02,32.54 DISP1.11 33.4,32.23 35.38,34.21 43.84,34.21 46.43,31.62 72.26,31.62 73.41,30.48 77.9,30.48 82.93,25.45 83.77,25.45 U$1.7
N$4  (via drill 0.35)  (1 unrouted)
  Top 0.203: v47.65,36.73 43.54,32.61 43.23,32.61 DISP1.7
  Bottom 0.203: 39.42,27.66 39.42,28.8 43.15,32.54 DISP1.7 | v47.65,36.73 48.03,36.35 59.08,36.35 62.05,33.38 79.73,33.38 86.36,26.75 86.36,25.45 U$1.6
N$5  (via drill 0.35)  (1 unrouted)
  Top 0.203: v38.81,22.25 v40.64,24.08 | v46.13,9.83 43.76,12.19 39.95,12.19 38.35,10.59 38.12,10.59 DISP1.4
  Bottom 0.203: v40.64,24.08 40.64,27.58 | v38.81,22.25 38.81,19.58 38.73,19.51 38.73,11.2 38.12,10.59 DISP1.4 | v46.13,9.83 78.28,9.83 83.01,5.11 83.77,5.11 U$1.4
N$6  (via drill 0.35)  (1 unrouted)
  Top 0.203: v41.86,24.38 41.02,23.55 41.02,18.97 33.02,10.97 DISP1.2 33.1,10.59 33.4,10.59 35,8.99 44.98,8.99 v45.14,8.84
  Bottom 0.203: v41.86,24.38 41.86,27.58 | v45.14,8.84 74.17,8.84 77.9,5.11 78.74,5.11 U$1.2
N$7  (via drill 0.35)  (1 unrouted)
  Top 0.203: v39.42,19.28 30.73,10.59 30.51,10.59 DISP1.1
  Bottom 0.203: 43.15,27.58 43.15,23.24 39.42,19.51 v39.42,19.28 | U$1.1 76.15,5.11 73.03,5.11 69.98,8.15 36.75,8.15 33.71,5.11 32.71,5.11 31.5,6.32 31.5,7.54 30.51,8.53 30.51,10.59 DISP1.1
N$8  (1 unrouted)
  Bottom 0.203: 44.45,30.94 44.45,33.07 43.69,33.83 36.83,33.83 35.61,32.61 DISP1.10 | 44.45,30.94 44.45,27.66 | U$1.9 78.74,25.45 77.9,25.45 73.03,30.33 62.74,30.33 62.13,30.94 44.53,30.94 44.45,30.94
N$9  (via drill 0.35)  (1 unrouted)
  Top 0.203: v48.64,19.28 v47.73,20.19 | v63.42,18.06 68,18.06 75.31,25.37 76.15,25.37 U$1.10
  Bottom 0.203: 45.74,27.58 45.74,22.17 v47.73,20.19 | 48.64,18.06 48.64,13.79 43.84,8.99 42.24,8.99 DISP1.5 | 48.64,18.06 v48.64,19.28 | v63.42,18.06 48.72,18.06 48.64,18.06
N$10  (via drill 0.35)  (1 unrouted)
  Top 0.203: 41.36,16.57 35.61,10.82 35.61,10.59 DISP1.3 | 41.36,16.57 v46.81,22.02 | v47.12,10.82 41.4,16.54 41.36,16.57
  Bottom 0.203: 46.96,27.58 46.96,22.17 v46.81,22.02 | v47.12,10.82 79.81,10.82 85.52,5.11 86.36,5.11 U$1.5
N$11  (via drill 0.35)  (1 unrouted)
  Top 0.203: v32.11,25.37 32.11,27.36 v29.13,30.33
  Bottom 0.203: 46.96,18.06 46.96,12.65 43.69,9.37 42.7,9.37 41.86,10.21 41.86,11.12 41.17,11.81 40.11,11.81 39.34,11.05 39.34,10.14 38.58,9.37 37.59,9.37 36.75,10.21 36.75,15.47 34.93,17.3 34.93,22.55 v32.11,25.37 | v29.13,30.33 29.13,31.24 30.43,32.54 DISP1.12
N$12  (via drill 0.35)  (1 unrouted)
  Top 0.203: v47.95,27.43 44.37,31.01 39.95,31.01 38.43,32.54 38.12,32.54 DISP1.9
  Bottom 0.203: 45.74,18.14 46.35,18.75 46.35,18.82 47.04,19.51 47.95,19.51 48.41,19.96 48.41,26.97 v47.95,27.43
N$13  (via drill 0.35)  (1 unrouted)
  Top 0.203: v41.86,23.47 v43.08,22.25
  Bottom 0.203: 44.45,18.14 44.45,20.88 v43.08,22.25 | v41.86,23.47 40.95,23.47 40.87,23.39 40.41,23.39 38.73,25.07 38.73,30.63 40.64,32.54 DISP1.8
N$14  (1 unrouted)
  Bottom 0.203: 43.23,18.06 43.23,10.59 DISP1.6
N$15  (via drill 0.35)  (1 unrouted)
  Top 0.203: v47.8,11.51 v42.54,16.76
  Bottom 0.203: 41.93,18.06 41.93,17.37 v42.54,16.76 | v47.8,11.51 61.82,11.51 68.53,18.21 | 68.53,18.21 68.53,21.18 71.5,24.15 80.03,24.15 81.25,25.37 U$1.8 | U$1.3 81.28,5.46 81.75,5.46 83.33,3.89 86.85,3.89 87.55,4.59 87.55,5.57 81.95,11.18 75.56,11.18 68.53,18.21
N$18  (1 unrouted)
N$19  (1 unrouted)
N$20  (1 unrouted)
N$28  (1 unrouted)
N$29  (1 unrouted)
N$30  (1 unrouted)
N$31  (1 unrouted)
N$32  (1 unrouted)
N$33  (1 unrouted)
N$46  (1 unrouted)
N$47  (1 unrouted)
N$48  (1 unrouted)
N$49  (1 unrouted)
N$50  (1 unrouted)
N$51  (1 unrouted)
N$52  (1 unrouted)
N$53  (1 unrouted)
N$54  (1 unrouted)
N$55  (1 unrouted)
N$56  (1 unrouted)
N$57
  Bottom 0.152: CAN_INTERFACE.1 15.04,10.82 15.88,11.66 15.88,19.96 15.27,20.57 CAN_SERIAL.1
N$58
  Bottom 0.152: CAN_SERIAL.2 13.97,20.57 13.97,15.62 14.96,14.63 CAN_INTERFACE.4
N$59  (1 unrouted)
N$60  (1 unrouted)
N$61  (1 unrouted)
N$62  (1 unrouted)
N$63  (1 unrouted)
N$64  (1 unrouted)
N$65  (1 unrouted)
N$66  (1 unrouted)
N$67  (1 unrouted)
OSC1
  Bottom 0.152: 6.84,13.14 5.13,11.43 Y1.2 | 6.84,13.14 8.48,14.78 8.86,14.78 C2.2 | CAN_SERIAL.8 6.35,20.57 6.35,19.28 3.99,16.92 3.99,16 6.81,13.18 6.84,13.14
OSC2
  Bottom 0.152: 7.64,16.46 5.13,16.46 Y1.1 | 7.64,16.46 8.64,16.46 10.24,14.86 11.38,14.86 C3.2 | 7.64,16.46 7.64,20.57 CAN_SERIAL.7
PARTY1  (via drill 0.35)
  Top 0.152: v20.98,33.6 26.85,33.6 35.46,24.99 48.26,24.99 59.08,14.17 62.74,14.17 69.52,7.39 69.52,7.32 69.98,6.86 69.98,6.4 PARTY1.2
  Bottom 0.152: v20.98,33.6 20.9,33.68 20.9,34.75 CONTROL.10
PARTY2  (via drill 0.35)
  Top 0.152: v19.76,28.5 19.76,25.91 v25.7,19.96
  Bottom 0.152: v19.76,28.5 21.59,30.33 21.59,34.75 CONTROL.11 | v25.7,19.96 25.86,19.96 28.68,17.14 28.68,6.25 31.34,3.58 38.05,3.58 40.79,6.32 PARTY2.2
RESET
  Top 0.152: R21.2 12.75,6.78 14.66,6.78 18.01,3.43 22.88,3.43 23.72,2.59 24.1,2.59 PROGRAM.3
  Bottom 0.152: CAN_SERIAL.17 13.97,30.18 13.13,29.34 11,29.34 10.69,29.64 10.69,30.94 10.54,31.09 9.78,31.09 9.63,30.94 9.63,29.49 12.29,26.82 19.46,26.82 19.68,27.05 22.05,27.05 22.43,26.67 22.43,26.21 CONTROL.29 22.5,26.14 22.5,10.97 25.32,8.15 25.32,3.73 24.18,2.59 PROGRAM.3
RPADDLE
  Bottom 0.152: CONTROL.25 25.63,26.14 25.63,20.8 25.09,20.27 25.09,10.36 28.37,7.09 28.37,6.1 31.19,3.28 41.86,3.28 43.76,5.18 45.97,5.18 47.12,6.32 RPADDLE.2
RX
  Bottom 0.152: CONTROL.30 21.67,26.14 21.67,15.24 22.2,14.71 22.2,9.53 24.1,7.62 PROGRAM.1
SCK  (via drill 0.35)
  Top 0.152: v15.65,26.21 19.68,30.25 v23.34,30.25
  Bottom 0.152: v15.65,26.21 12.45,26.21 8.94,29.72 8.94,30.18 CAN_SERIAL.13 | v23.34,30.25 23.57,30.25 26.54,33.22 27.15,33.22 CONTROL.17
SS
  Bottom 0.152: CAN_SERIAL.16 12.75,30.25 12.75,31.55 16.87,35.66 23.65,35.66 24.03,35.28 24.03,34.82 CONTROL.14
T/S-TOOGLE  (via drill 0.35)
  Top 0.152: v25.4,27.36 26.77,27.36 v28.14,25.98 | v46.81,20.19 59.16,7.85 60.45,7.85 61.9,6.4 62.36,6.4 T/S-TOOGLE.2
  Bottom 0.152: v25.4,27.36 24.87,26.82 24.87,26.21 CONTROL.26 | v28.14,25.98 32.41,25.98 35.54,22.86 42.24,22.86 42.54,23.17 42.54,28.35 42.77,28.57 43.61,28.57 43.84,28.35 43.84,23.17 v46.81,20.19
TX
  Bottom 0.152: CONTROL.31 20.9,26.14 20.9,15.54 21.9,14.55 21.9,7.32 24.1,5.11 PROGRAM.2
VCC  (via drill 0.35)  (13 unrouted)
  Top 0.406: v12.75,9.6 12.75,8.53 R21.1 | POWER.1 6.35,33.68 6.12,33.91 6.12,36.65 C1.1 5.97,36.8 8.03,36.8 R20.2 8.1,36.65 8.1,36.04 8.48,35.66 8.94,35.66 v13.36,31.24 | v36.83,23.47 v36.83,22.25 36.75,22.1 v30.43,15.77 | v62.43,13.56 62.43,11.35 67.08,6.71 67.08,6.4 PARTY1.1
  Bottom 0.406: C6.1 10.92,17.75 10.92,17.22 14.81,13.33 CAN_INTERFACE.3 14.66,13.26 12.75,11.35 12.75,10.21 | 12.75,10.21 v12.75,9.6 | 17.55,30.18 18.47,30.18 18.54,30.1 CONTROL.4 | 17.55,30.18 15.27,30.18 CAN_SERIAL.18 15.11,30.33 15.11,30.48 14.35,31.24 v13.36,31.24 | 17.55,30.18 17.55,31.32 17.86,31.62 18.54,31.62 CONTROL.6 | 12.75,10.21 4.6,10.21 3.53,11.28 3.53,30.1 6.27,32.84 POWER.1 6.35,33.07 9.7,36.42 25.48,36.42 28.14,33.76 28.14,32.84 27.84,32.54 27.15,32.54 CONTROL.18 27,32.39 26.39,32.39 26.16,32.16 26.16,27.13 26.47,26.82 26.47,20.04 30.35,16.15 30.35,15.93 v30.43,15.77 30.43,12.42 29.13,11.12 29.13,7.7 30.28,6.55 LPADDLE.1 30.35,6.32 32.64,4.04 35.61,4.04 PARTY2.1 39.27,7.7 41.33,7.7 42.62,6.4 44.22,6.4 RPADDLE.1 44.45,6.4 45.74,7.7 47.73,7.7 49.02,6.4 51.84,6.4 LAUNCH.1 52.07,6.4 53.37,7.7 55.35,7.7 56.64,6.4 59.46,6.4 T/S-TOOGLE.1 59.69,6.4 60.98,7.7 62.97,7.7 64.26,6.4 67.08,6.4 PARTY1.1 | 63.5,19.28 63.5,19.05 64.26,18.29 | 64.26,18.29 65.25,18.29 66.01,19.05 66.01,19.28 | v36.83,22.25 IC1.9 | v36.83,23.47 36.83,24.84 34.32,27.36 34.32,27.58 IC1.18 | v62.43,13.56 64.19,15.32 64.19,18.14 64.26,18.29
(copper drawn outside any net)
  shapes: Top area x2